# Altium schematic sheet mainBoard.SchDoc
size A2
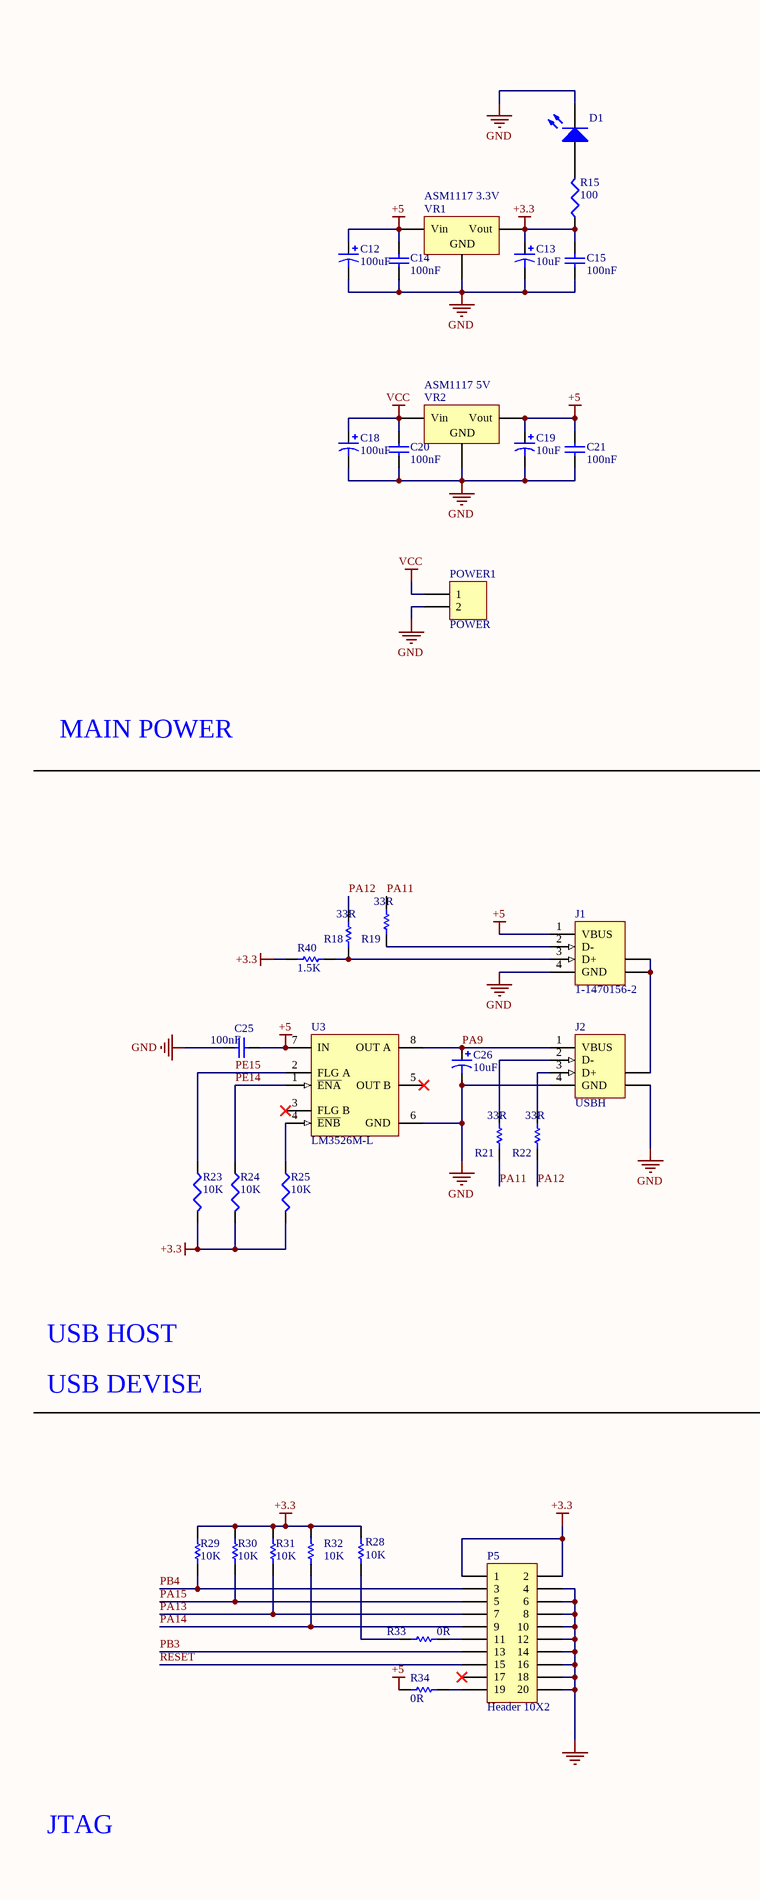
[diagram p0: mainBoard.SchDoc, left]
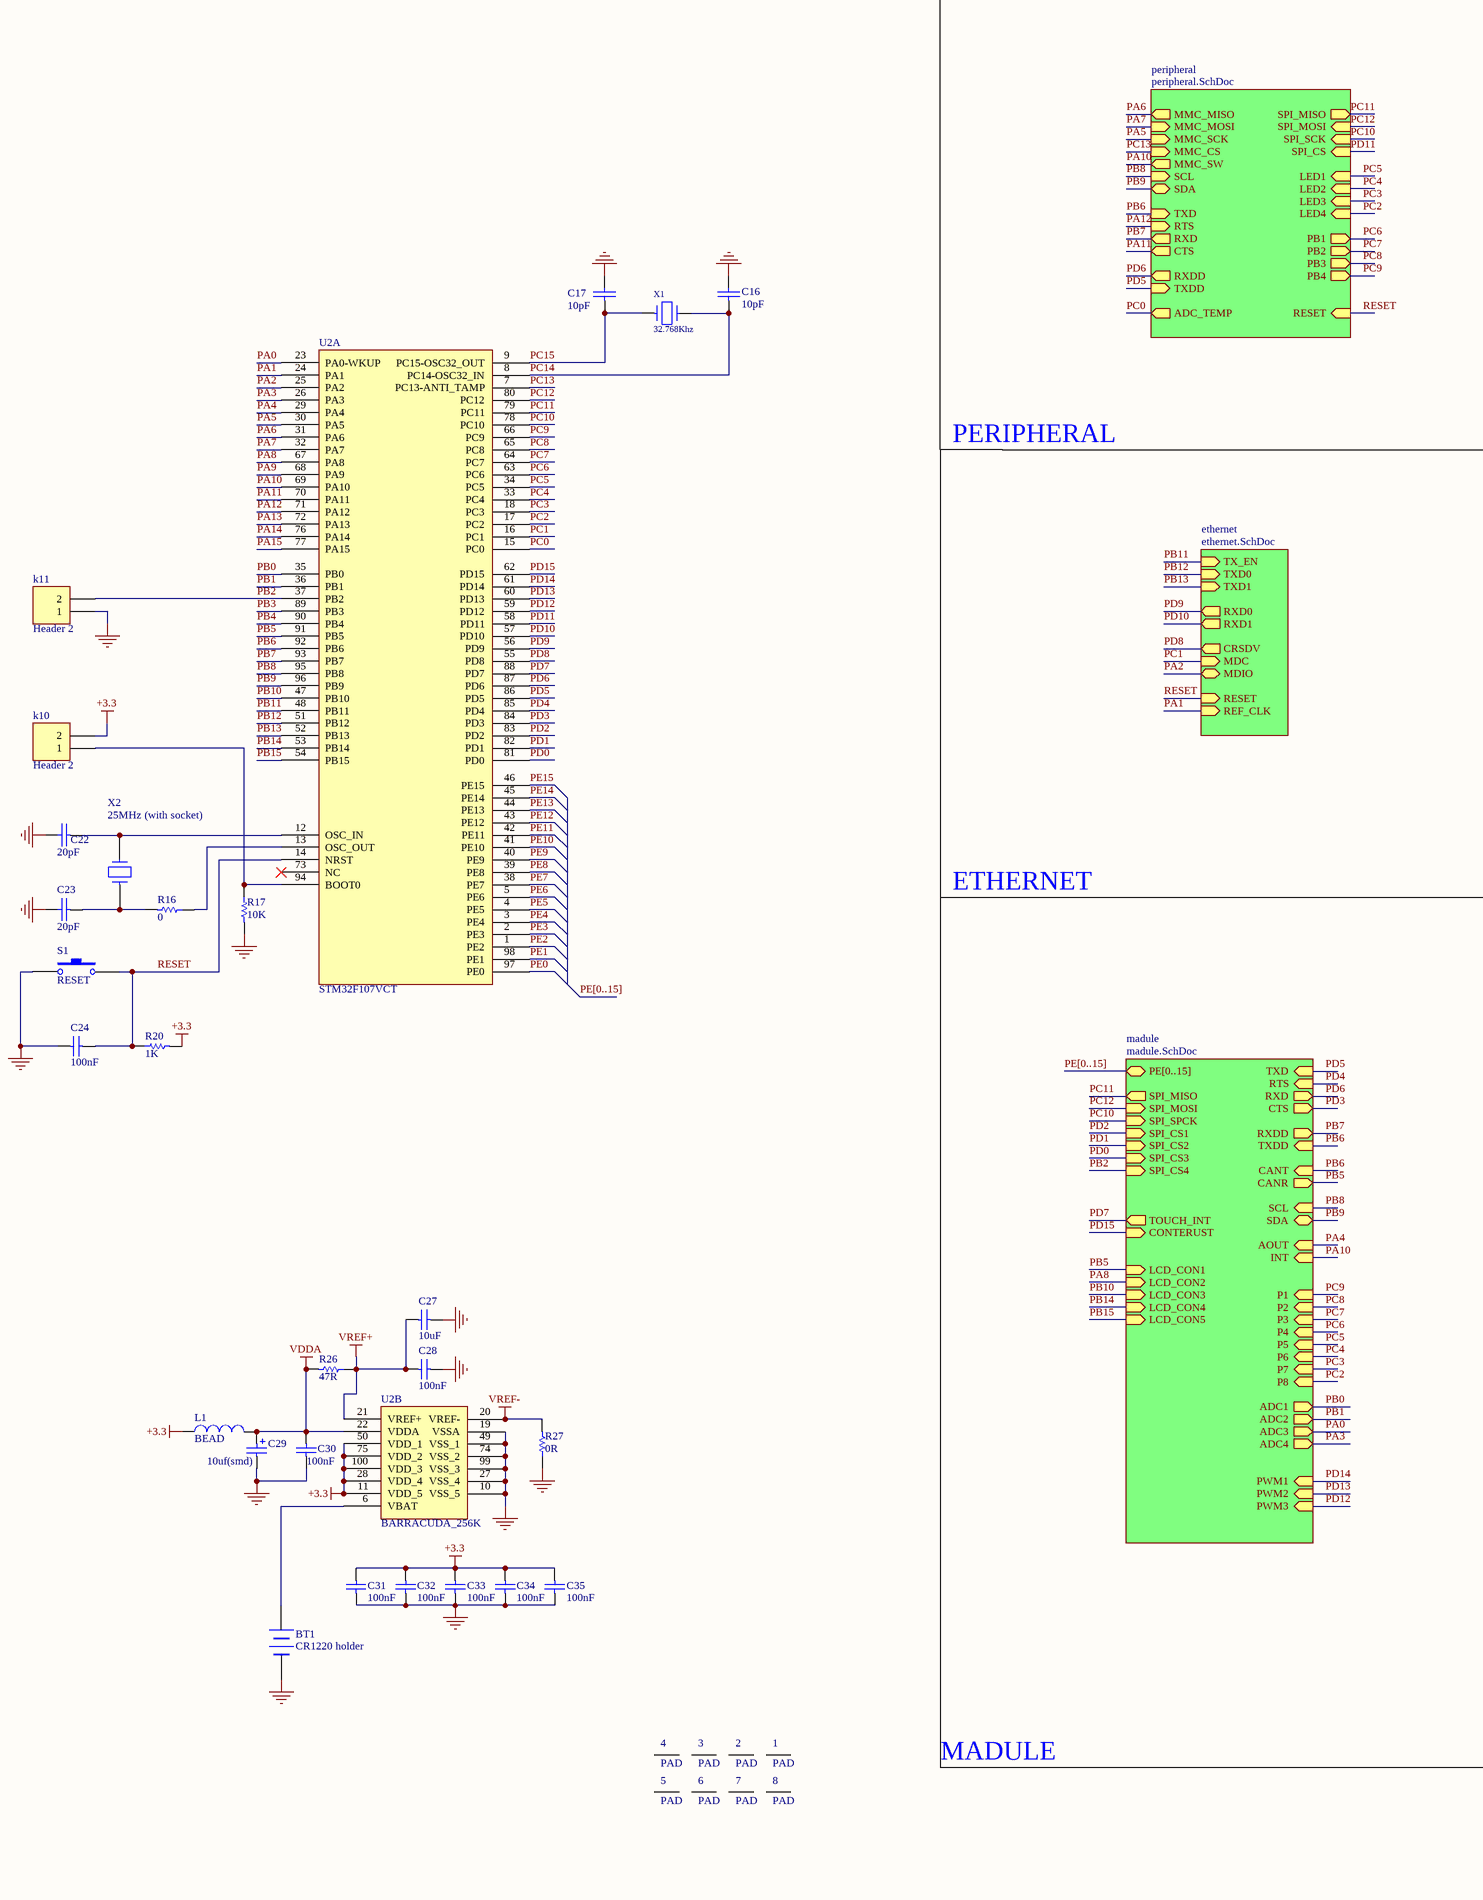
[diagram p1: mainBoard.SchDoc, right]

## Parts
1  PAD  [pad]
2  PAD  [pad]
3  PAD  [pad]
4  PAD  [pad]
5  PAD  [pad]
6  PAD  [pad]
7  PAD  [pad]
8  PAD  [pad]
BT1  CR1220 holder  [BAT]
C12  100uf  [CAP470]
C13  10uf  [CAP10]
C14  100nF  [1206]
C15  100nF  [1206]
C16  10pF  [1206]
C17  10pF  [1206]
C18  100uf  [CAP470]
C19  10uf  [CAP10]
C20  100nF  [1206]
C21  100nF  [1206]
C22  20pF  [1206]
C23  20pF  [1206]
C24  100nF  [1206]
C25  100nF  [1206]
C26  10uf  [CAP10]
C27  10uF  [1206]
C28  100nF  [1206]
C29  10uf(smd)  [1206]
C30  100nF  [1206]
C31  100nF  [0805]
C32  100nF  [0805]
C33  100nF  [0805]
C34  100nF  [0805]
C35  100nF  [0805]
D1  LED0  [LED-0805]  (value not drawn)
J1  1-1470156-2  [440247]
J2  USBH  [787761]
k10  Header 2  [HDR1X2]
k11  Header 2  [HDR1X2]
L1  BEAD  [1206]
P5  Header 10X2  [IDC20S]
POWER1  POWER  [power jack]
R15  100  [1206]
R16  0  [1206]
R17  10K  [1206]
R18  33R  [1206]
R19  33R  [1206]
R20  1K  [1206]
R21  33R  [1206]
R22  33R  [1206]
R23  10K  [1206]
R24  10K  [1206]
R25  10K  [1206]
R26  47R  [1206]
R27  0R  [1206]
R28  10K  [1206]
R29  10K  [1206]
R30  10K  [1206]
R31  10K  [1206]
R32  10K  [1206]
R33  0R  [1206]
R34  0R  [1206]
R40  1.5K  [1206]
S1  RESET  [SWSMD]
U2  STM32F107VCT  [TQ100_TOOL]  (parts A,B of 2)
U3  LM3526M-L  [M08A_N]
VR1  ASM1117 3.3V  [Regolator]
VR2  ASM1117 5V  [Regolator]
X1  32.768Khz  [OSCILATOR]
X2  25MHz (with socket)  [XTAL3]

## Sub-sheets
ethernet = ethernet.SchDoc: TX_EN (in), TXD0 (in), TXD1 (in), RXD0 (out), RXD1 (out), CRSDV (out), MDC (in), MDIO (bidir), RESET (in), REF_CLK (in)
madule = madule.SchDoc: PE[0..15] (bidir), TXD (in), RTS (in), RXD (out), CTS (out), RXDD (out), TXDD (in), CANT (in), CANR (out), SCL (in), SDA (bidir), AOUT (in), INT (in), SPI_MOSI (in), SPI_MISO (out), SPI_SPCK (in), SPI_CS1 (in), SPI_CS2 (in), SPI_CS3 (in), SPI_CS4 (in), P1 (in), P2 (in), P3 (in), P4 (in), P5 (in), P6 (in), P7 (in), P8 (in), ADC1 (out), ADC2 (out), ADC3 (out), ADC4 (out), PWM1 (in), PWM2 (in), PWM3 (in), TOUCH_INT (out), CONTERUST (in), LCD_CON1 (in), LCD_CON2 (in), LCD_CON3 (in), LCD_CON4 (in), LCD_CON5 (in)
peripheral = peripheral.SchDoc: MMC_MISO (out), MMC_MOSI (in), MMC_SCK (in), MMC_CS (in), SCL (in), SDA (bidir), TXD (in), RTS (in), RXD (out), CTS (out), RXDD (out), TXDD (in), SPI_MISO (out), SPI_MOSI (in), SPI_SCK (in), SPI_CS (in), LED1 (in), LED2 (in), LED3 (in), LED4 (in), PB1 (out), PB2 (out), PB3 (out), PB4 (out), RESET (in), ADC_TEMP (out), MMC_SW (out)

## Nets
+3.3: C13.1 C15.1 C31.1 C32.1 C33.1 C34.1 C35.1 k10.2 L1.1 P5.1 P5.2 R15.1 R20.2 R23.2 R24.2 R25.2 R28.2 R29.2 R30.2 R31.2 R32.2 R40.1 U2.11(VDD_5) U2.28(VDD_4) U2.50(VDD_1) U2.75(VDD_2) U2.100(VDD_3) VR1.4(Vout)
+5: C12.1 C14.1 C19.1 C21.1 C25.1 J1.1(VBUS) R34.2 U3.7(IN) VR1.3(Vin) VR2.4(Vout)
GND: BT1.2(-) C12.2 C13.2 C14.2 C15.2 C16.2 C17.2 C18.2 C19.2 C20.2 C21.2 C22.2 C23.2 C24.1 C25.2 C26.2 C27.2 C28.2 C29.2 C30.2 C31.2 C32.2 C33.2 C34.2 C35.2 D1.2(K) J1.4(GND) J2.4(GND) J2.6(SHLD) k11.1 P5.4 P5.6 P5.8 P5.10 P5.12 P5.14 P5.16 P5.18 P5.20 POWER1.2 R17.2 R27.1 S1.1 U2.10(VSS_5) U2.19(VSSA) U2.27(VSS_4) U2.49(VSS_1) U2.74(VSS_2) U2.99(VSS_3) U3.6(GND) VR1.1(GND) VR2.1(GND)
VCC: C18.1 C20.1 POWER1.1 VR2.3(Vin)
VDDA: C29.1 C30.1 L1.2 R26.2 U2.22(VDDA)
VREF+: C27.1 C28.1 R26.1 U2.21(VREF+)
VREF-: R27.2 U2.20(VREF-)
PA0: U2.23(PA0-WKUP) ; sheet madule/ADC3
PA1: U2.24(PA1) ; sheet ethernet/REF_CLK
PA2: U2.25(PA2) ; sheet ethernet/MDIO
PA3: U2.26(PA3) ; sheet madule/ADC4
PA4: U2.29(PA4) ; sheet madule/AOUT
PA5: U2.30(PA5) ; sheet peripheral/MMC_SCK
PA6: U2.31(PA6) ; sheet peripheral/MMC_MISO
PA7: U2.32(PA7) ; sheet peripheral/MMC_MOSI
PA8: U2.67(PA8) ; sheet madule/LCD_CON2
PA9: C26.1 J2.1(VBUS) U2.68(PA9) U3.8(OUT_A)
PA10: U2.69(PA10) ; sheet peripheral/MMC_SW, sheet madule/INT
PA11: R19.1 R21.2 U2.70(PA11) ; sheet peripheral/CTS
PA12: R18.1 R22.2 U2.71(PA12) ; sheet peripheral/RTS
PA13: P5.7 R31.1 U2.72(PA13)
PA14: P5.9 R32.1 U2.76(PA14)
PA15: P5.5 R30.1 U2.77(PA15)
PB0: U2.35(PB0) ; sheet madule/ADC1
PB1: U2.36(PB1) ; sheet madule/ADC2
PB2: k11.2 U2.37(PB2) ; sheet madule/SPI_CS4
PB3: P5.13 U2.89(PB3)
PB4: P5.3 R29.1 U2.90(PB4)
PB5: U2.91(PB5) ; sheet madule/CANR, sheet madule/LCD_CON1
PB6: U2.92(PB6) ; sheet peripheral/TXD, sheet madule/TXDD, sheet madule/CANT
PB7: U2.93(PB7) ; sheet peripheral/RXD, sheet madule/RXDD
PB8: U2.95(PB8) ; sheet peripheral/SCL, sheet madule/SCL
PB9: U2.96(PB9) ; sheet peripheral/SDA, sheet madule/SDA
PB10: U2.47(PB10) ; sheet madule/LCD_CON3
PB11: U2.48(PB11) ; sheet ethernet/TX_EN
PB12: U2.51(PB12) ; sheet ethernet/TXD0
PB13: U2.52(PB13) ; sheet ethernet/TXD1
PB14: U2.53(PB14) ; sheet madule/LCD_CON4
PB15: U2.54(PB15) ; sheet madule/LCD_CON5
PC0: U2.15(PC0) ; sheet peripheral/ADC_TEMP
PC1: U2.16(PC1) ; sheet ethernet/MDC
PC2: U2.17(PC2) ; sheet peripheral/LED4, sheet madule/P8
PC3: U2.18(PC3) ; sheet peripheral/LED3, sheet madule/P7
PC4: U2.33(PC4) ; sheet peripheral/LED2, sheet madule/P6
PC5: U2.34(PC5) ; sheet peripheral/LED1, sheet madule/P5
PC6: U2.63(PC6) ; sheet peripheral/PB1, sheet madule/P4
PC7: U2.64(PC7) ; sheet peripheral/PB2, sheet madule/P3
PC8: U2.65(PC8) ; sheet peripheral/PB3, sheet madule/P2
PC9: U2.66(PC9) ; sheet peripheral/PB4, sheet madule/P1
PC10: U2.78(PC10) ; sheet peripheral/SPI_SCK, sheet madule/SPI_SPCK
PC11: U2.79(PC11) ; sheet peripheral/SPI_MISO, sheet madule/SPI_MISO
PC12: U2.80(PC12) ; sheet peripheral/SPI_MOSI, sheet madule/SPI_MOSI
PC13: U2.7(PC13-ANTI_TAMP) ; sheet peripheral/MMC_CS
PC14: C16.1 U2.8(PC14-OSC32_IN) X1.2
PC15: C17.1 U2.9(PC15-OSC32_OUT) X1.1
PD0: U2.81(PD0) ; sheet madule/SPI_CS3
PD1: U2.82(PD1) ; sheet madule/SPI_CS2
PD2: U2.83(PD2) ; sheet madule/SPI_CS1
PD3: U2.84(PD3) ; sheet madule/CTS
PD4: U2.85(PD4) ; sheet madule/RTS
PD5: U2.86(PD5) ; sheet peripheral/TXDD, sheet madule/TXD
PD6: U2.87(PD6) ; sheet peripheral/RXDD, sheet madule/RXD
PD7: U2.88(PD7) ; sheet madule/TOUCH_INT
PD8: U2.55(PD8) ; sheet ethernet/CRSDV
PD9: U2.56(PD9) ; sheet ethernet/RXD0
PD10: U2.57(PD10) ; sheet ethernet/RXD1
PD11: U2.58(PD11) ; sheet peripheral/SPI_CS
PD12: U2.59(PD12) ; sheet madule/PWM3
PD13: U2.60(PD13) ; sheet madule/PWM2
PD14: U2.61(PD14) ; sheet madule/PWM1
PD15: U2.62(PD15) ; sheet madule/CONTERUST
PE0: U2.97(PE0)
PE1: U2.98(PE1)
PE2: U2.1(PE2)
PE3: U2.2(PE3)
PE4: U2.3(PE4)
PE5: U2.4(PE5)
PE6: U2.5(PE6)
PE7: U2.38(PE7)
PE8: U2.39(PE8)
PE9: U2.40(PE9)
PE10: U2.41(PE10)
PE11: U2.42(PE11)
PE12: U2.43(PE12)
PE13: U2.44(PE13)
PE14: R24.1 U2.45(PE14) U3.1(~{ENA})
PE15: R23.1 U2.46(PE15) U3.2(FLG_A)
RESET: C24.2 P5.15 R20.1 S1.2 U2.14(NRST) ; sheet peripheral/RESET, sheet ethernet/RESET
NetBT1_1: BT1.1(+) U2.6(VBAT)
NetC22_1: C22.1 U2.12(OSC_IN) X2.2
NetC23_1: C23.1 R16.2 X2.1
NetD1_1: D1.1(A) R15.2
NetJ1_2: J1.2(D-) R19.2
NetJ1_3: J1.3(D+) R18.2 R40.2
NetJ1_5: J1.5(SHLD) J1.6(SHLD) J2.5(SHLD)
NetJ2_2: J2.2(D-) R21.1
NetJ2_3: J2.3(D+) R22.1
Netk10_1: k10.1 R17.1 U2.94(BOOT0)
NetP5_11: P5.11 R33.1
NetP5_19: P5.19 R34.1
NetR16_1: R16.1 U2.13(OSC_OUT)
NetR25_1: R25.1 U3.4(~{ENB})
NetR28_1: R28.1 R33.2

Not connected (* = marked no-connect by the designer): 1 1; 2 1; 3 1; 4 1; 5 1; 6 1; 7 1; 8 1; P5 17*; U2 73(NC)*; U3 3(FLG_B)* 5(OUT_B)*

## Buses and harness runs
bus PE[0..15]
bus PE[0..15] = sheet madule/PE[0..15]

## Notes on the sheet
- PERIPHERAL
- MAIN POWER
- ETHERNET
- USB HOST
- USB DEVISE
- MADULE
- JTAG

## Library data of the parts
BT1 = BATTERY
C12 C13 C18 C19 C26 C29 = Cap Pol1: Polarized Capacitor (Radial); Published: 8-Jun-2000; Publisher: Altium Limited
  C12 C18: LatestRevisionDate: 17-Jul-2002; LatestRevisionNote: Re-released for DXP Platform.; PackageReference: RB7.6-15; Value: 100uF
  C13 C19 C26: LatestRevisionDate: 17-Jul-2002; LatestRevisionNote: Re-released for DXP Platform.; PackageReference: RB7.6-15; Value: 10uF
  C29: Revision: July-2002: Re-released for DXP Platform.; Value: 10uF
C14 C15 C20 C21 = Cap Semi: Capacitor (Semiconductor SIM Model); Published: 8-Jun-2000; LatestRevisionDate: 29-May-2009; LatestRevisionNote: IPC-7351 Footprint Added.; PackageReference: 0603C; Publisher: Altium Limited; PackageDescription: Chip Capacitor; Value: 100nF
C16 C17 C22 C23 = CAP: Capacitor
C24 = CAP: Capacitor; Value: 100pF; Published: 8-Jun-2000; Revision: July-2002: Re-released for DXP Platform.; Publisher: Altium Limited
C25 = Cap: Capacitor; Published: 8-Jun-2000; LatestRevisionDate: 17-Jul-2002; LatestRevisionNote: Re-released for DXP Platform.; PackageReference: RAD-0.3; Publisher: Altium Limited; PackageDescription: Radial Cap, Thru-Hole; 2 Leads; 0.3 in Pin Spacing; Value: 100nF
C27 C28 C30-C35 = Cap: Capacitor; Value: 10nF; Published: 8-Jun-2000; Revision: July-2002: Re-released for DXP Platform.; Publisher: Altium Limited
D1 = LED0: Typical INFRARED GaAs LED; Published: 8-Jun-2000; LatestRevisionDate: 08-Jul-2005; LatestRevisionNote: Mech Layer 1 removed.; PackageReference: LED-0; Publisher: Altium Limited
J1 = 1-1470156-2: USB 1.1, Right Angle, Thru-Hole, B Type, Receptacle, 4 Position, Black; ContactMaterial: Phosphor Bronze; ContactPlating: Gold over Nickel; TerminationLength: 3.00mm [0.118in.]; PCB_Layout: Complies with manufacturer's recommendation.; DrillSize: Corresponds to nominal value.; PanelGround: Without; Published: 15-Jul-2004; DatasheetDocument: 02-Jun-2001; PackageDocument: 02-Jun-2001; PackageReference: 1-1470156; Publisher: Altium Limited; HousingMaterial: Glass-Filled Thermoplastic; ComponentLink1Description: Manufacturer Link; ComponentLink1URL: http://www.tycoelectronics.com/; ComponentLink2Description: Packaging Specification; ComponentLink2URL: http://ecommas.tycoelectronics.com/commerce/DocumentDelivery/DDEController?Action=showdoc&DocId=Customer+Drawing%7F1470156%7FO%7Ftif%7FEnglish%7FC_1470156_O.tif
J2 = 787761-3: USB 1.1, Right Angle, Thru-Hole, A Type, Receptacle, 4 Position, Natural; ContactMaterial: Copper Alloy; ContactPlating: Gold Flash over Palladium Nickel or Gold (30) over Nickel; TerminationLength: 2.84mm [0.112in.]; PCB_Layout: Complies with manufacturer's recommendation.; DrillSize: Corresponds to nominal value.; PanelGround: Without; Published: 15-Jul-2004; DatasheetDocument: 11-Jan-2004; PackageDocument: 11-Jan-2004; PackageReference: 787761; Publisher: Altium Limited; HousingMaterial: Thermoplastic; ComponentLink1Description: Manufacturer Link; ComponentLink1URL: http://www.tycoelectronics.com/; ComponentLink2Description: Packaging Specification; ComponentLink2URL: http://ecommas.tycoelectronics.com/commerce/DocumentDelivery/DDEController?Action=showdoc&DocId=Customer+Drawing%7F787761%7FH%7Ftif%7FEnglish%7FENG_CD_787761_H.tif
k10 k11 = Header 2: Header, 2-Pin; LatestRevisionDate: 17-Jul-2002; LatestRevisionNote: Re-released for DXP Platform.; Publisher: Altium Limited
L1 = Inductor: Value: 100uH; Published: 8-Jun-2000; Revision: July-2002: Re-released for DXP Platform.; Publisher: Altium Limited
P5 = Header 10X2: Header, 10-Pin, Dual row; LatestRevisionDate: 17-Jul-2002; LatestRevisionNote: Re-released for DXP Platform.; Publisher: Altium Limited
POWER1 = Header 2H: Header, 2-Pin, Right Angle; LatestRevisionDate: 17-Jul-2002; LatestRevisionNote: Re-released for DXP Platform.; Publisher: Altium Limited
R15 = Res3: Resistor; Published: 8-Jun-2000; LatestRevisionDate: 29-May-2009; LatestRevisionNote: IPC-7351 Footprint Added.; PackageReference: J1-0603; Publisher: Altium Limited; PackageDescription: Chip Resistor; Value: 100
R16 R26-R34 = Res1: Resistor; Value: 1K; Published: 8-Jun-2000; Revision: July-2002: Re-released for DXP Platform.; Publisher: Altium Limited
R17 = res1: Resistor; Value: 1K; Published: 8-Jun-2000; Revision: July-2002: Re-released for DXP Platform.; Publisher: Altium Limited
R18 R19 R21 R22 R40 = Res1: Resistor; Value: 10K; Published: 8-Jun-2000; LatestRevisionDate: 17-Jul-2002; LatestRevisionNote: Re-released for DXP Platform.; PackageReference: AXIAL-0.3; Publisher: Altium Limited; PackageDescription: Axial Device, Thru-Hole; 2 Leads; 0.3 in Pin Spacing
R20 = res1: Resistor; Published: 8-Jun-2000; Revision: July-2002: Re-released for DXP Platform.; Publisher: Altium Limited; Value: 1K
R23-R25 = RES1
S1 = SW-PB: Switch; Published: 24-Mar-1999; LatestRevisionDate: 17-Jul-2002; LatestRevisionNote: Re-released for DXP Platform.; PackageReference: SPST-2; Publisher: Altium Limited
U2 = BARRACUDA_256K
U3 = LM3526M-L: Dual Port USB Power Switch and Over-Current Protection; Manufacturer: National Semiconductor; CompType: MiscPower; PackageTopMarking: NSZXTT*3526*M-L; PowerWise: N; Published: 4-Dec-2008; DatasheetVersion: Mar-2005; PackageVersion: revL, Sep-2006; PackageReference: M08A; Publisher: Altium Limited; PackageDescription: SOIC Narrow, 4.9 x 3.9 x 1.45mm, 8 Lead, 1.27mm Pitch; PartNumber: LM3526M-L; RoHS: O; PinCount: 8; DigiKeyPartNumber: LM3526M-L-ND; Code_JEDEC: MS-012-AA; Code_IPC: SOIC127P600-8; ComponentLink1Description: LM3526 Datasheet; ComponentLink1URL: http://www.national.com/ds/LM/LM3526.pdf; ComponentLink2Description: LM3526 Web Page; ComponentLink2URL: http://www.national.com/pf/LM/LM3526.html; ComponentLink3Description: M08A Package Page; ComponentLink3URL: http://www.national.com/packaging/folders/m08a.html
VR1 VR2 = Volt Reg_1: Voltage Regulator; Published: 24-Mar-1999; LatestRevisionDate: 29-May-2009; LatestRevisionNote: IPC-7351 Footprint Added.; PackageReference: D2PAK; Publisher: Altium Limited; PackageDescription: 3-Pin Transistor Outline Package 2.54 mm Pitch, 15.1 mm Lead Span
X1 = XTAL: Crystal
X2 = CRYSTAL